# Altium schematic sheet BlockDiagram.SchDoc: Block Diagram
size Letter; Author: Norman Chong; Organization: Midnight Sun Solar Rayce Car Team; Address1: University of Waterloo; Address2: 200 University Ave W; Address3: Waterloo, ON, Canada; Address4: N2L 3E9; Revision: 1.24; SheetNumber: 1; SheetTotal: 3; Website: www.uwmidsun.com
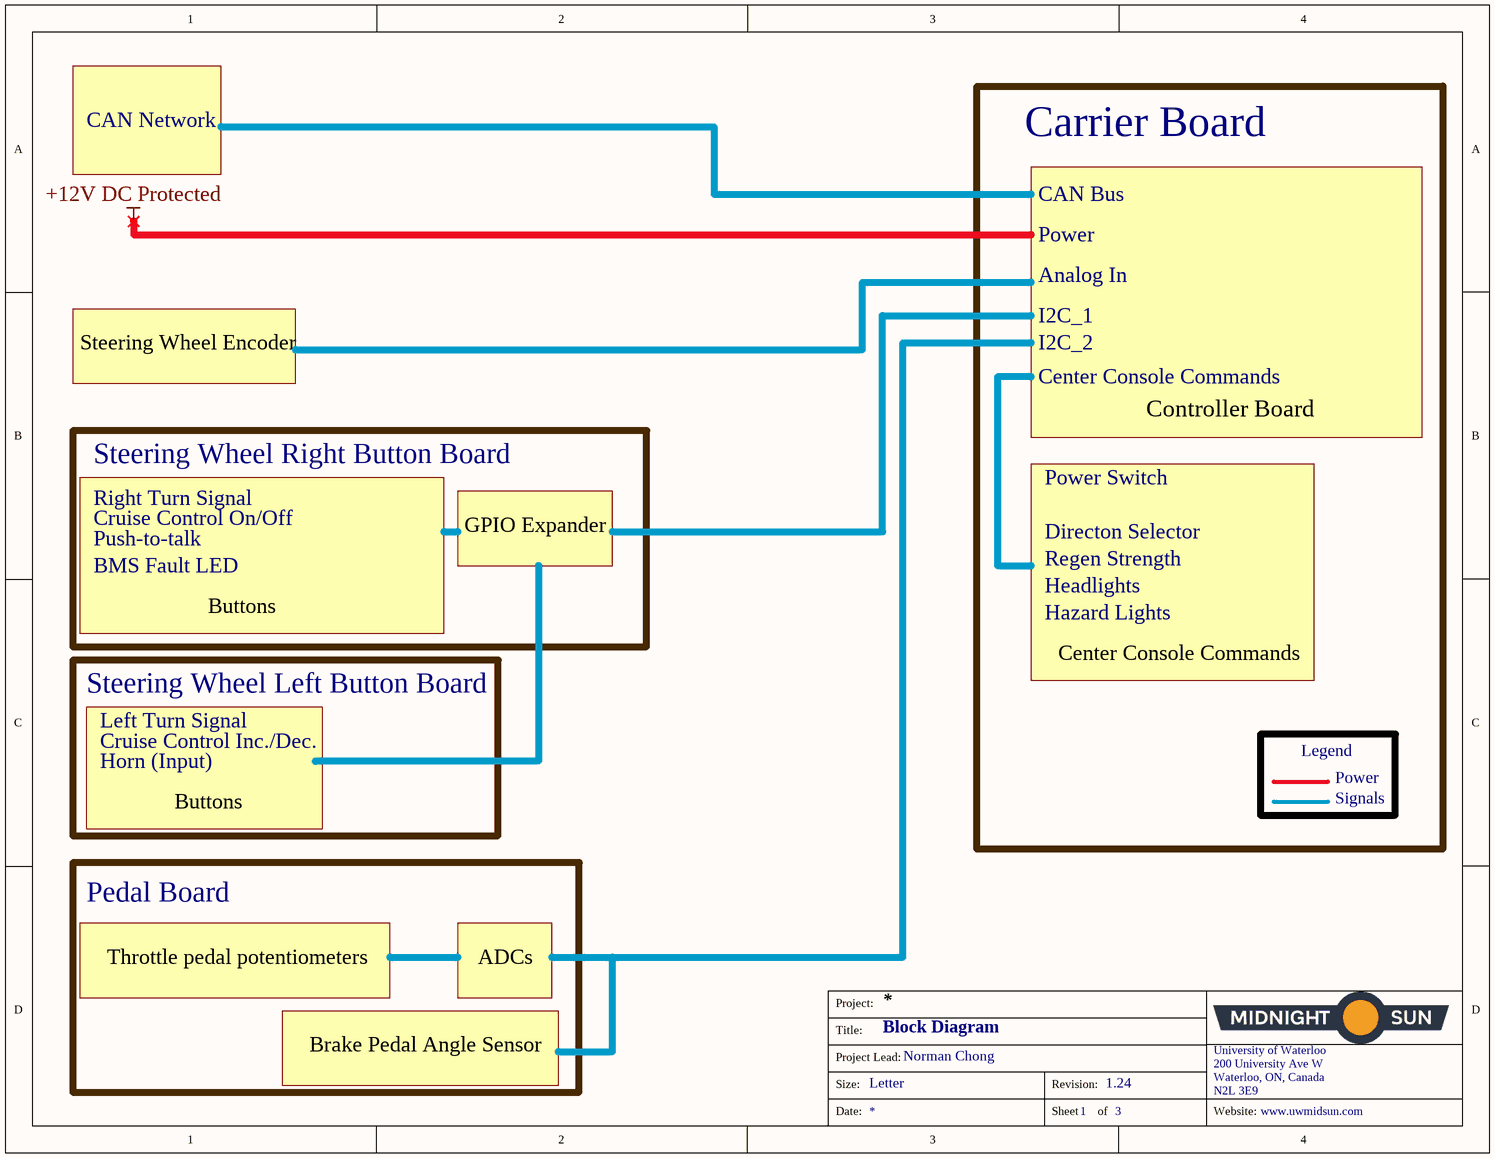
[diagram p0: BlockDiagram.SchDoc]

## Notes on the sheet
- CAN Network
- Carrier Board
- CAN Bus
- Power
- Analog In
- Steering Wheel Encoder
- I2C_1
- I2C_2
- Center Console Commands
- Controller Board
- Right Turn Signal
- Steering Wheel Right Button Board
- Power Switch
- Cruise Control On/Off
- Push-to-talk
- GPIO Expander
- Directon Selector
- Regen Strength
- BMS Fault LED
- Buttons
- Headlights
- Hazard Lights
- Steering Wheel Left Button Board
- Horn (Input)
- Cruise Control Inc./Dec.
- Left Turn Signal
- Legend
- Signals
- Pedal Board
- Throttle pedal potentiometers
- ADCs
- Brake Pedal Angle Sensor
- Labels drawn without touching a wire or pin: +12V DC Protected
- Project:
- Title:
- Size:
- Project Lead:
- Letter
- Revision:
- University of Waterloo
- 200 University Ave W
- Waterloo, ON, Canada
- N2L 3E9
- Date:
- Sheet
- of
- Website: